# Altium schematic sheet Charger.SchDoc
size A; SheetNumber: 4; SheetTotal: 4
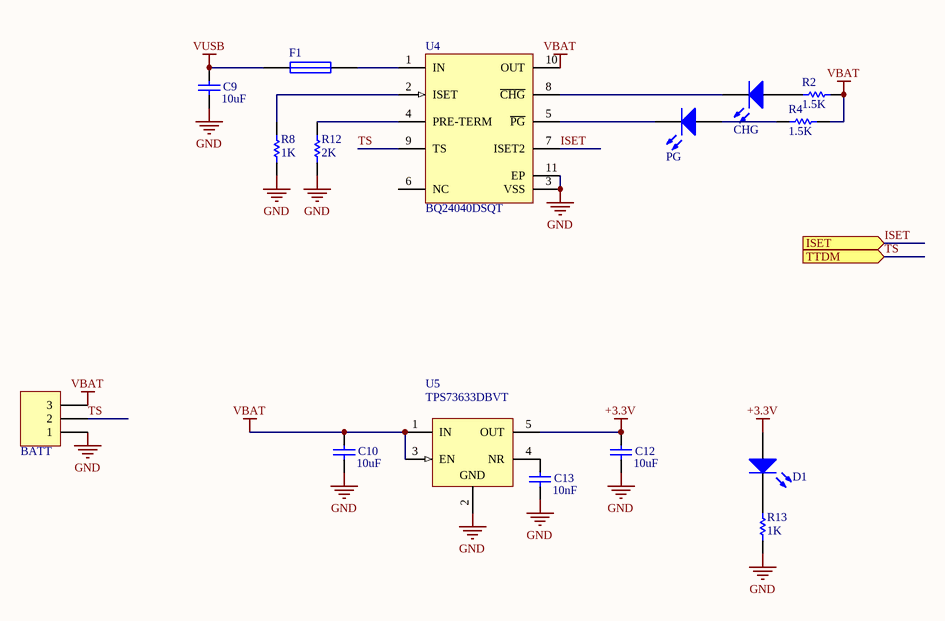
[diagram p0: Charger.SchDoc]

## Parts
BATT  CONN-3  [PicoBlade-3-S]  (value not drawn)
C9  10uF  [C805]
C10  10uF  [C805]
C12  10uF  [C805]
C13  10nF  [C603]
CHG  LED  [led-0603]  (value not drawn)
D1  LED  [led-0603]  (value not drawn)
F1  Fuse 1  [ptc-0805]  (value not drawn)
PG  LED  [led-0603]  (value not drawn)
R2  1.5K  [R0603]
R4  1.5K  [R0603]
R8  1K  [R0603]
R12  2K  [R0603]
R13  1K  [R0603]
U4  BQ24040DSQT  [SON40P200X200X80-11N]
U5  TPS73633DBVT  [DBV0005A_M]

## Ports
ISET (in), TTDM (in)

## Nets
+3.3V: C12.2 D1.1(A) U5.5(OUT)
GND: BATT.1 C9.1 C10.1 C12.1 C13.1 R8.2 R12.2 R13.2 U4.3(VSS) U4.11(EP) U5.2(GND)
VBAT: BATT.3 C10.2 R2.2 R4.2 U4.10(OUT) U5.1(IN) U5.3(EN)
VUSB: C9.2 F1.1
ISET: U4.7(ISET2) ; port ISET
TS: BATT.2 U4.9(TS) ; port TTDM
NetC13_2: C13.2 U5.4(NR)
NetCHG_1: CHG.1(A) R2.1
NetCHG_2: CHG.2(K) U4.8(~{CHG})
NetD1_2: D1.2(K) R13.1
NetF1_2: F1.2 U4.1(IN)
NetPG_1: PG.1(A) R4.1
NetPG_2: PG.2(K) U4.5(~{PG})
NetR8_1: R8.1 U4.2(ISET)
NetR12_1: R12.1 U4.4(PRE-TERM)

Not connected (* = marked no-connect by the designer): U4 6(NC)

## Library data of the parts
BATT = CONN-3: Header, 3-Pin
C9 C10 C12 C13 = Cap: Capacitor; Designer: Parsa Malekpour
  C9 C10 C12: Value: 10uF
  C13: Value: 10nF
F1 = Fuse 1: Fuse; Published: 8-Jun-2000; LatestRevisionDate: 17-Jul-2002; LatestRevisionNote: Re-released for DXP Platform.; PackageReference: PIN-W2/E2.8; Publisher: Altium Limited; PackageDescription: Thru-Hole; 2 Leads
R2 R4 R8 R12 R13 = Resistor: Designer: Parsa Malekpour
  R2 R4: Value: 1.5K
  R8 R13: Value: 1K
  R12: Value: 2K
U4 = CMP-0321-00457-2: 800 mA, Single-Input, Single Cell Li-Ion Battery Charger with Auto Start. Vovp=6.6 V, 3.5 V, -40 to 85 degC, 10-pin SON (DSQ), Green (RoHS & no Sb/Br); Manufacturer: Texas Instruments; Lead Acid: N; SubFamily: Battery Charge Management; Vin(Min)(V): 3.5; PackageReference: DSQ0010A; NiMH: N; DatasheetVersion: SLUS941A; Over Voltage Protection: N; PackageDescription: 10-Pin Plastic Small Outline No-Lead, 2 x 2 x 0.8 mm Body, 0.4 mm Pitch, Exposed Pad; Li-Polymer: N; Li-Ion: N; ComponentLink1Description: Datasheet; ComponentLink1URL: http://www.ti.com/general/docs/lit/getliterature.tsp?genericPartNumber=BQ24040&fileType=pdf; PartNumber: BQ24040DSQT; NiCd: N; Eco-Plan: Green (RoHS & no Sb/Br); Mounting Technology: Surface Mount; PackageVersion: revB, Apr-2010
U5 = CMP-0395-00251-2: Single Output Low Noise LDO, 400 mA, Fixed 3.3 V Output, 1.7 to 5.5 V Input, with Reverse Current Protection, 5-pin SOT-23 (DBV), -40 to 85 degC, Green (RoHS & no Sb/Br); Manufacturer: Texas Instruments; Vin(Min)(V): 1.7; Vin(Max)(V): 5.5; Vout Adj(Min)(V): 3.3; Accuracy(%): 1; SubFamily: Single Channel LDO; Rating: Catalog; Iout(Max)(A): 0.4; Iq(Typ)(mA): 0.3; Vdo(Typ)(mV): 75; ComponentLink1URL: http://www.ti.com/; ComponentLink4URL: Samples URL:http://www.ti.com/product/tps73633#samples; ComponentLink2Description: Datasheet; ComponentLink3URL: http://www.ti.com/litv/pdf/mpds018i; Code_JEDEC: MO-178; ComponentLink4Description: URL Link1; Eco-Plan: Green (RoHS & no Sb/Br); PartNumber: TPS73633DBVT; PackageVersion: 4073253-4/K; ComponentLink2URL: http://www.ti.com/general/docs/lit/getliterature.tsp?genericPartNumber=TPS73633&fileType=pdf; Fixed Output Options(V): 3.3; Mounting Technology: Surface Mount; PackageDescription: 5-Pin Plastic Small Outline, Body 1.60 Ãƒâ€” 2.90 mm, Pitch 0.95 mm; DatasheetVersion: SBVS038T; Vout Adj(Max)(V): 3.3; ComponentLink1Description: Manufacturer URL; ComponentLink3Description: Package Specification; PackageReference: DBV0005A